# EAGLE design pot (EAGLE 6.6.0)
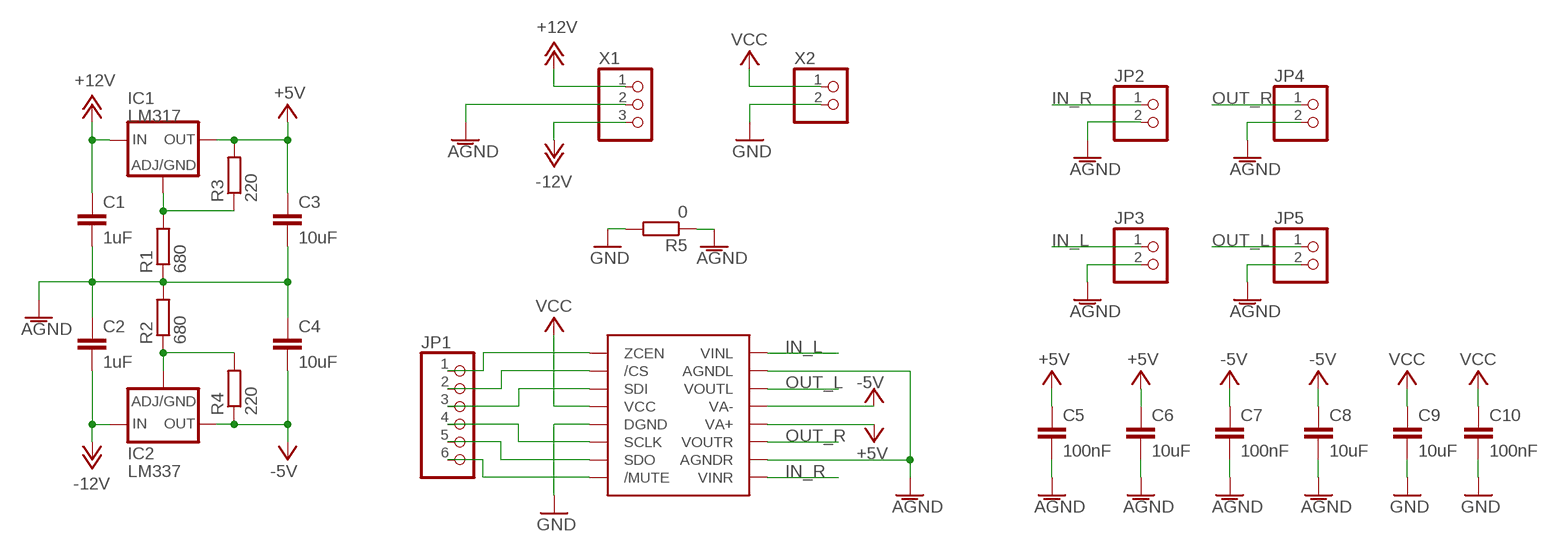
[diagram p0: schematic, sheet 1]

## Parts
C1  1uF  C-EUC0805K  [C0805K]
C2  1uF  C-EUC0805K  [C0805K]
C3  10uF  C-EUC0805K  [C0805K]
C4  10uF  C-EUC0805K  [C0805K]
C5  100nF  C-EUC0805K  [C0805K]
C6  10uF  C-EUC0805K  [C0805K]
C7  100nF  C-EUC0805K  [C0805K]
C8  10uF  C-EUC0805K  [C0805K]
C9  10uF  C-EUC0805K  [C0805K]
C10  100nF  C-EUC0805K  [C0805K]
IC1  LM317  [SOT223]
IC2  LM337  [SOT223]
JP1  PINHD-1X6  [1X06]
JP2  PINHD-1X2  [1X02]
JP3  PINHD-1X2  [1X02]
JP4  PINHD-1X2  [1X02]
JP5  PINHD-1X2  [1X02]
R1  680  R-EU_  [R0805]
R2  680  R-EU_  [R0805]
R3  220  R-EU_  [R0805]
R4  220  R-EU_  [R0805]
R5  0  R-EU_  [R0805]
U1  PGA2311  [SO16W]
X1  22-23-2031  [22-23-2031]
X2  22-23-2021  [22-23-2021]

## Nets
+5V: C3.1 C5.1 C6.1 IC1.2(OUT) IC1.4(OUT) R3.2 U1.12(VA+)
+12V: C1.1 IC1.3(IN) X1.1
-5V: C4.1 C7.1 C8.1 IC2.3(OUT) R4.1 U1.13(VA-)
-12V: C2.1 IC2.2(IN) IC2.4(IN) X1.3
/CS: JP1.2 U1.2(/CS)
/MUTE: JP1.6 U1.8(/MUTE)
AGND: C1.2 C2.2 C3.2 C4.2 C5.2 C6.2 C7.2 C8.2 JP2.2 JP3.2 JP4.2 JP5.2 R1.1 R2.2 R5.1 U1.10(AGNDR) U1.15(AGNDL) X1.2
GND: C9.2 C10.2 R5.2 U1.5(DGND) X2.2
IN_L: JP3.1 U1.16(VINL)
IN_R: JP2.1 U1.9(VINR)
N$4: IC2.1(ADJ) R2.1 R4.2
N$5: IC1.1(ADJ) R1.2 R3.1
OUT_L: JP5.1 U1.14(VOUTL)
OUT_R: JP4.1 U1.11(VOUTR)
SCLK: JP1.4 U1.6(SCLK)
SDI: JP1.3 U1.3(SDI)
SDO: JP1.5 U1.7(SDO)
VCC: C9.1 C10.1 U1.4(VCC) X2.1
ZCEN: JP1.1 U1.1(ZCEN)

## Library data of the parts
C1-C10 = amp:C-EU: CAPACITOR, European symbol
IC1 = amp:LM317
IC2 = amp:LM337
JP1 = amp:PINHD-1X6: PIN HEADER
JP2-JP5 = amp:PINHD-1X2: PIN HEADER
R1-R5 = amp:R-EU_: RESISTOR, European symbol
U1 = amp:PGA2311
X1 = amp:22-23-2031: .100" (2.54mm) Center Header - 3 Pin
X2 = amp:22-23-2021: .100" (2.54mm) Center Header - 2 Pin

## Board
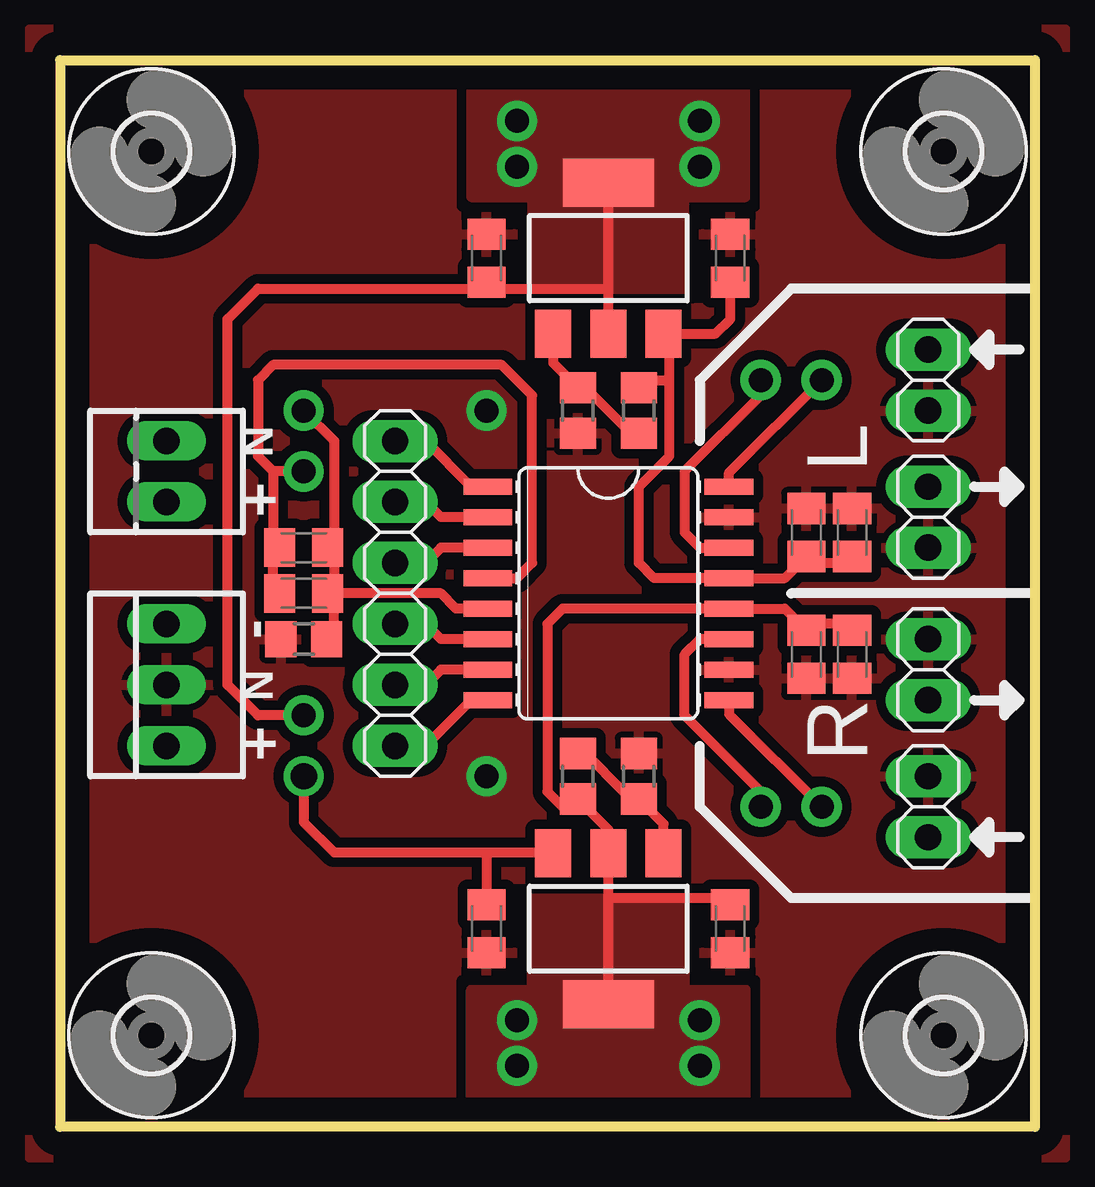
[diagram p1: board, top side]
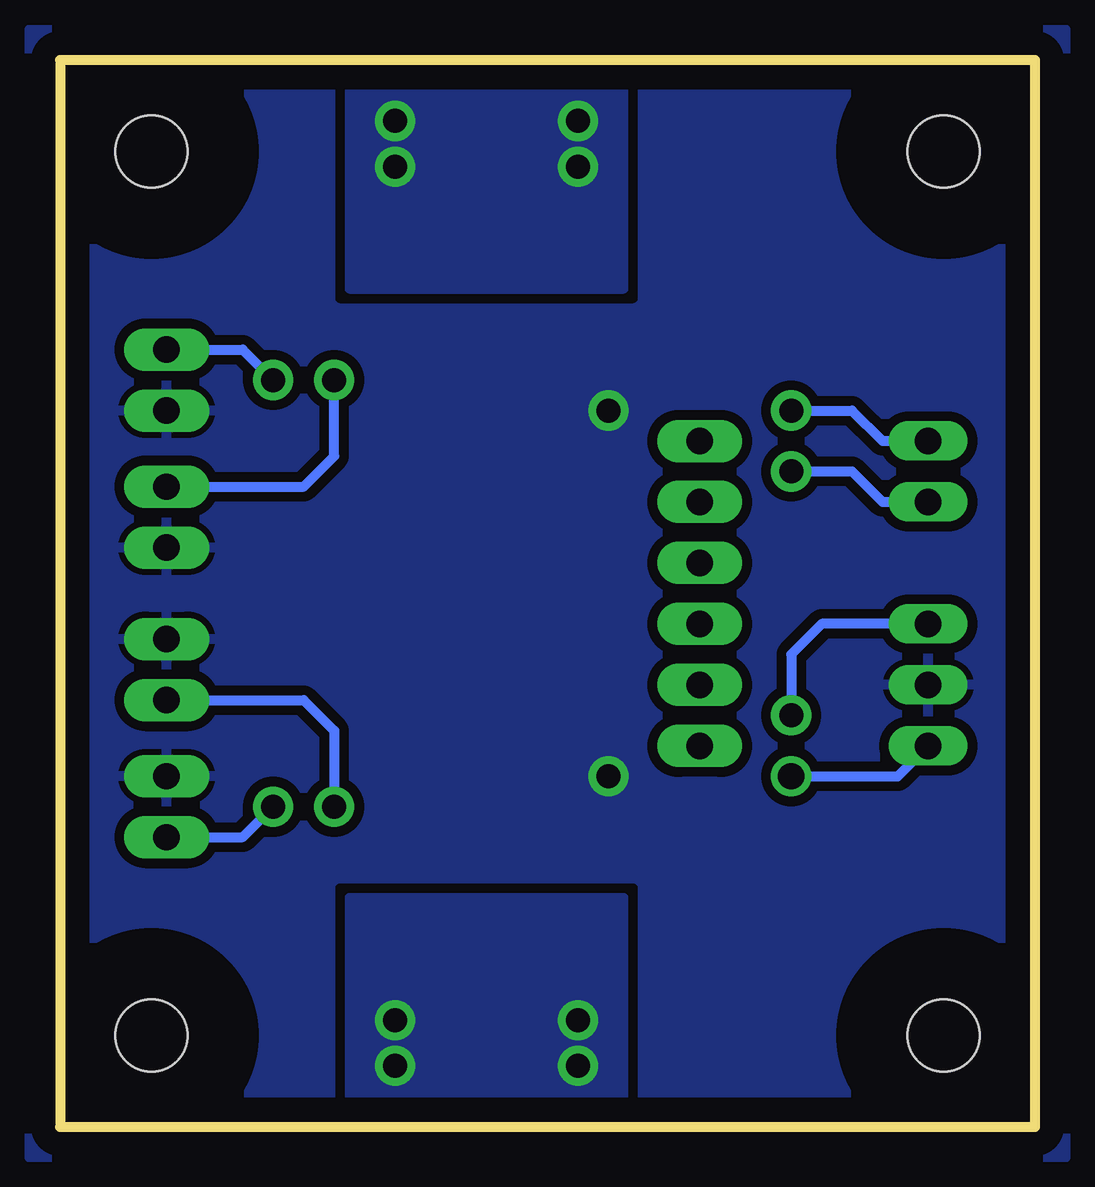
[diagram p2: board, bottom side, seen from below]

Size 40.64 x 44.45 mm. Coordinates in mm from the lower left corner, seen from the top.
Outline: 0.64,44.44 0,44.45
Outline: 0,44.45 0,0 40.64,0 40.64,44.45 0,44.45
Copper layers (1*16): Top 0.035mm / dielectric 1.5mm / Bottom 0.035mm
Design rules "default": minimum track width 10mil, minimum drill 24mil, track to track 8mil, track to pad 8mil, pad to pad 8mil, via to via 8mil, smd to smd 8mil, copper to edge 40mil, drill to drill 8mil, minimum pad ring 10mil, minimum via ring 8mil, stop-mask expansion 4mil, vias tented up to drill 0mil, thermal gap 10mil

### Footprints (pad centres in the part's own frame; a part is rotated, then mirrored left to right if it is on the bottom)
C0805K = smd 1.3 x 1.6: 1 -1,0; 2 1,0
SOT223 = smd 1.5 x 2: 1 -2.3,-3.15; 2 0,-3.15; 3 2.3,-3.15 | smd 3.8 x 2: 4 0,3.15
1X06 = drill 1.1 pad 1.778 long: 1 -6.35,0; 2 -3.81,0; 3 -1.27,0; 4 1.27,0; 5 3.81,0; 6 6.35,0
1X02 = drill 1.1 pad 1.778 long: 1 -1.27,0; 2 1.27,0
R0805 = smd 1.3 x 1.5: 1 -0.95,0; 2 0.95,0
SO16W = smd 0.66 x 2.032: 1 -4.445,-5.029; 2 -3.175,-5.029; 3 -1.905,-5.029; 4 -0.635,-5.029; 5 0.635,-5.029; 6 1.905,-5.029; 7 3.175,-5.029; 8 4.445,-5.029; 9 4.445,5.029; 10 3.175,5.029; 11 1.905,5.029; 12 0.635,5.029; 13 -0.635,5.029; 14 -1.905,5.029; 15 -3.175,5.029; 16 -4.445,5.029
3,0 = hole 3: 0,0
22-23-2031 = drill 1.1 long: 1 -2.54,0; 2 0,0; 3 2.54,0
22-23-2021 = drill 1.1 long: 1 -1.27,0; 2 1.27,0

### Placement (x,y rotation side)
C1  [C0805K]  17.78,8.26 270 top
C2  [C0805K]  17.78,36.2 90 top
C3  [C0805K]  27.94,8.26 270 top
C4  [C0805K]  27.94,36.2 90 top
C5  31.11,19.69 270 top
C6  33.02,19.69 270 top
C7  33.02,24.77 90 top
C8  31.11,24.77 90 top
C9  [C0805K]  10.16,22.23 0 top
C10  [C0805K]  10.16,24.13 0 top
IC1  22.86,8.26 180 top
IC2  22.86,36.2 0 top
JP1  13.97,22.23 270 top
JP2  36.2,13.33 90 top
JP3  36.2,31.12 270 top
JP4  36.2,19.05 90 top
JP5  36.2,25.4 270 top
R1  [R0805]  24.13,14.61 270 top
R2  [R0805]  21.59,29.85 270 top
R3  [R0805]  21.59,14.61 270 top
R4  [R0805]  24.13,29.85 270 top
R5  [R0805]  10.16,20.32 0 top
U1  [SO16W]  22.86,22.23 270 top
U$1  [3,0]  3.81,3.81 0 top
U$2  [3,0]  3.81,40.64 0 top
U$3  [3,0]  36.83,40.64 0 top
U$4  [3,0]  36.83,3.81 0 top
X1  4.45,18.42 90 top
X2  4.45,27.31 90 top

### Tracks (layer width: path | path; a pad name or v marks a point on that pad's centre or on a via)
+5V  (via drill 1 pad 1.68)
  Top 0.254: 27.94,21.59 U1.12
  Top 0.406: IC1.4 22.86,9.53 | 22.86,9.53 IC1.2 22.86,12.38 R3.2 21.27,13.33 20.95,13.33 20.32,13.97 20.32,20.96 20.95,21.59 U1.12 30.21,21.59 C5.1 31.39,20.96 33.02,20.96 C6.1 | C3.1 27.94,9.53 22.86,9.53
  other vias: 19.05,4.45 19.05,2.54 26.67,4.45 26.67,2.54
  pour Top (isolate 0.406, no thermals): 19.68,9.53 26.04,9.53 26.04,5.71 28.57,5.71 28.57,0.64 17.14,0.64 17.14,5.71 19.68,5.71
  pour Bottom (isolate 0.406): 28.57,0.64 17.14,0.64 17.14,9.53 28.57,9.53
+12V  (via drill 1.1 pad 1.68)
  Top 0.406: 17.78,11.43 C1.1 | 17.78,11.43 11.43,11.43 10.16,12.7 v10.16,14.61 | 17.78,11.43 20.54,11.43 IC1.3
  Bottom 0.406: v10.16,14.61 5.71,14.61 X1.1
-5V
  Top 0.406: C4.1 27.94,33.66 27.33,33.04 IC2.3 25.4,33.04 25.4,31.12 | 25.4,31.12 25.4,27.94 24.13,26.67 24.13,23.5 24.77,22.86 U1.13 30.21,22.86 C8.1 31.11,23.5 32.75,23.5 C7.1 | R4.1 24.13,31.12 25.4,31.12
-12V  (via drill 1 pad 1.68)
  Top 0.254: 22.86,33.02 IC2.2
  Top 0.406: IC2.2 22.86,34.92 | 22.86,34.92 IC2.4 | 22.86,34.92 17.78,34.92 C2.1 17.51,34.92 8.26,34.92 6.99,33.66 6.99,18.42 8.26,17.15 v10.16,17.15
  Bottom 0.406: X1.3 8.89,20.96 10.16,19.69 v10.16,17.15
  other vias: 19.05,41.91 19.05,40 26.67,41.91 26.67,40
  pour Top (no thermals): 26.04,34.92 26.04,38.73 28.57,38.73 28.57,43.81 17.14,43.81 17.14,38.73 19.68,38.73 19.68,34.92
  pour Bottom: 28.57,43.81 28.57,34.92 17.14,34.92 17.14,43.81
/CS
  Top 0.406: U1.2 15.88,25.4 15.24,26.04 JP1.2
/MUTE
  Top 0.406: U1.8 17.14,17.78 15.24,15.88 JP1.6
AGND  (via drill 1 pad 1.68)
  Top 0.406: 31.39,26.04 C8.2
  other vias: 17.78,14.61 17.78,29.85
  pour Bottom (isolate 0.406, rank 2): -1.27,45.72 -1.27,-1.27 41.91,-1.27 41.91,45.72
  pour Top (isolate 0.406, rank 2): -1.27,45.72 -1.27,-1.27 41.91,-1.27 41.91,45.72
GND  (via drill 1 pad 1.68)
  Top 0.406: U1.5 16.51,21.59 15.88,22.23 C9.2 | C9.2 11.43,22.5 11.43,23.5 11.16,23.77 C10.2 11.43,24.4 11.43,28.58 v10.16,29.85 | R5.2 11.43,20.32 11.43,21.96 C9.2
  Bottom 0.406: v10.16,29.85 7.62,29.85 6.35,28.58 X2.2
IN_L  (via drill 1 pad 1.68)
  Top 0.406: U1.16 27.89,27.25 v31.75,31.12
  Bottom 0.406: JP3.1 33.02,32.38 v31.75,31.12
IN_R  (via drill 1 pad 1.68)
  Top 0.406: U1.9 27.89,17.2 v31.75,13.33
  Bottom 0.406: JP2.1 33.02,12.06 v31.75,13.33
N$4
  Top 0.406: 24.13,28.58 R4.2 23.82,29.21 23.5,29.21 21.91,30.8 R2.1 20.56,31.83 IC2.1
N$5
  Top 0.406: R3.1 21.91,15.55 23.5,13.97 23.82,13.97 R1.2 25.16,12.62 IC1.1
OUT_L  (via drill 1 pad 1.68)
  Top 0.406: v29.21,31.12 29.21,30.48 26.04,27.31 26.04,24.77 26.67,24.13 U1.14
  Bottom 0.406: JP5.1 30.48,26.67 29.21,27.94 v29.21,31.12
OUT_R  (via drill 1 pad 1.68)
  Top 0.406: U1.11 26.67,20.32 26.04,19.69 26.04,17.15 29.21,13.97 v29.21,13.33
  Bottom 0.406: JP4.1 30.48,17.78 29.21,16.51 v29.21,13.33
SCLK
  Top 0.406: U1.6 15.88,20.32 15.24,20.96 JP1.4
SDI
  Top 0.406: U1.3 15.88,24.13 15.24,23.5 JP1.3
SDO
  Top 0.406: U1.7 15.88,19.05 15.24,18.42 JP1.5
VCC  (via drill 1 pad 1.68)
  Top 0.406: v10.16,27.31 8.89,27.31 | 8.89,27.31 8.89,24.4 C10.1 8.89,23.86 8.89,22.23 C9.1 | U1.4 19.05,22.86 19.68,23.5 19.68,30.48 18.41,31.75 8.89,31.75 8.26,31.12 8.26,27.94 8.89,27.31
  Bottom 0.406: v10.16,27.31 7.62,27.31 6.35,26.04 X2.1
ZCEN
  Top 0.406: U1.1 17.14,26.67 15.24,28.58 JP1.1

### Text on the board
tNames: N | L | + | - | N | + | R